# EAGLE design RePico (EAGLE 9.2.1)

## Sheet 1 of 2
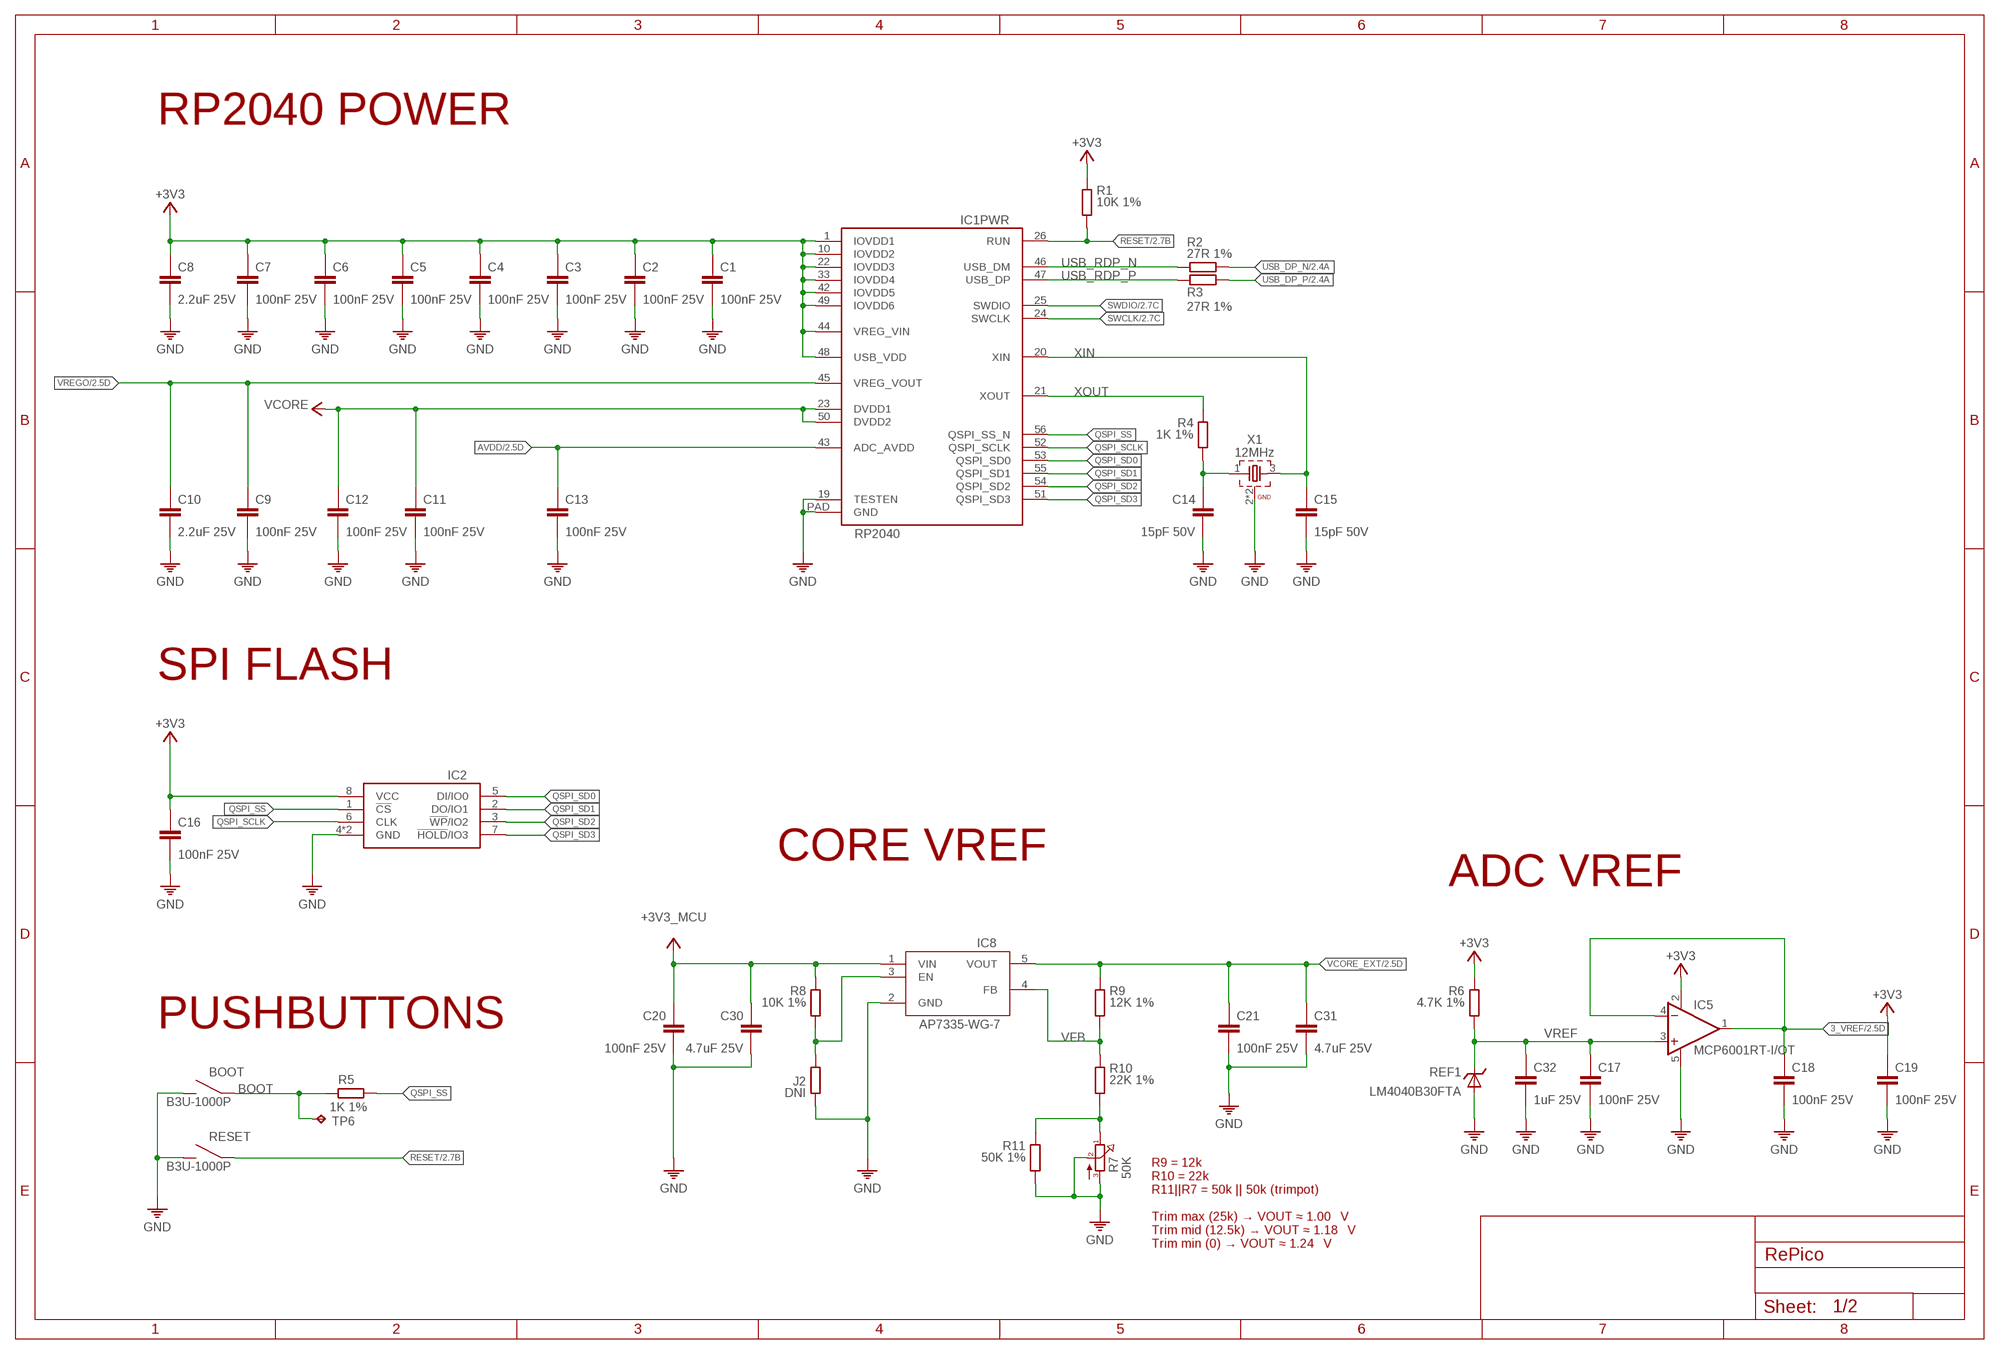
[diagram p0: schematic, sheet 1]

### Parts
BOOT  B3U-1000P  B3U-1000P  [B3U-1000P]
C1  100nF 25V  100NF-25V-0201  [0201]
C2  100nF 25V  100NF-25V-0201  [0201]
C3  100nF 25V  100NF-25V-0201  [0201]
C4  100nF 25V  100NF-25V-0201  [0201]
C5  100nF 25V  100NF-25V-0201  [0201]
C6  100nF 25V  100NF-25V-0201  [0201]
C7  100nF 25V  100NF-25V-0201  [0201]
C8  2.2uF 25V  2.2UF-25V0402  [0402]
C9  100nF 25V  100NF-25V-0201  [0201]
C10  2.2uF 25V  2.2UF-25V0402  [0402]
C11  100nF 25V  100NF-25V-0201  [0201]
C12  100nF 25V  100NF-25V-0201  [0201]
C13  100nF 25V  100NF-25V-0201  [0201]
C14  15pF 50V  15PF-50V0201  [0201]
C15  15pF 50V  15PF-50V0201  [0201]
C16  100nF 25V  100NF-25V-0201  [0201]
C17  100nF 25V  100NF-25V-0201  [0201]
C18  100nF 25V  100NF-25V-0201  [0201]
C19  100nF 25V  100NF-25V-0201  [0201]
C20  100nF 25V  100NF-25V-0201  [0201]
C21  100nF 25V  100NF-25V-0201  [0201]
C30  4.7uF 25V  4.7UF-25V0402  [0402]
C31  4.7uF 25V  4.7UF-25V0402  [0402]
C32  1uF 25V  1UF-25V0402  [0402]
IC1  RP2040  RP-2040  [QFN56]
IC2  W25Q128JVP  [SON127P600X500X75-8N]
IC5  MCP6001RT-I/OT  MCP6001RT  [SOT23-5]
IC8  AP7335-WG-7  AP7335-WG-7  [SOT23-5]
J2  DNI  R0201  [R0201]
R1  10K 1%  10K-1%0201  [0201]
R2  27R 1%  27R-1%0201  [0201]
R3  27R 1%  27R-1%0201  [0201]
R4  1K 1%  1K-1%0201  [0201]
R5  1K 1%  1K-1%0201  [0201]
R6  4.7K 1%  4.7K-1%0402  [0402]
R7  50K  TRIM-3X3.6-TC33X-2-503E  [SMD_TRIMM]
R8  10K 1%  10K-1%0201  [0201]
R9  12K 1%  12K-1%0201  [0201]
R10  22K 1%  22K-1%0201  [0201]
R11  50K 1%  50K-1%0402  [0402]
REF1  LM4040B30FTA  LM4040BXX  [SOT23]
RESET  B3U-1000P  B3U-1000P  [B3U-1000P]
TP6  TPB1,27  [B1,27]
X1  12MHz  CRYSTAL-3225X322512MSB4SI  [WE-XTAL_CFPX-180]

### Nets
3_VREF: C18.1 IC5.1(OUT) IC5.4(-IN) ; also sheet 2
+3V3: C1.1 C2.1 C3.1 C4.1 C5.1 C6.1 C7.1 C8.1 C16.1 C19.1 IC1.1(PWR:IOVDD1) IC1.10(PWR:IOVDD2) IC1.22(PWR:IOVDD3) IC1.33(PWR:IOVDD4) IC1.42(PWR:IOVDD5) IC1.44(PWR:VREG_VIN) IC1.48(PWR:USB_VDD) IC1.49(PWR:IOVDD6) IC2.8(VCC) IC5.2(V+) R1.1 R6.1 ; also sheet 2
+3V3_MCU: C20.1 C30.1 IC8.1(VIN) R8.1
AVDD: C13.1 IC1.43(PWR:ADC_AVDD) ; also sheet 2
BOOT: BOOT.1 R5.1 TP6.TP
FBTRIM: R7.1 R10.2 R11.1
GND: BOOT.2 C1.2 C2.2 C3.2 C4.2 C5.2 C6.2 C7.2 C8.2 C9.2 C10.2 C11.2 C12.2 C13.2 C14.2 C15.2 C16.2 C17.2 C18.2 C19.2 C20.2 C21.2 C30.2 C31.2 C32.2 IC1.19(PWR:TESTEN) IC1.PAD(PWR:GND) IC2.4(GND) IC2.PAD(GND) IC5.5(V-) IC8.2(GND) J2.2 R7.2 R7.3 R11.2 REF1.2(A) REF1.3(A) RESET.2 X1.2(GND) X1.4(GND) ; also sheet 2
N$2: IC8.3(EN) J2.1 R8.2
QSPI_SCLK: IC1.52(PWR:QSPI_SCLK) IC2.6(CLK)
QSPI_SD0: IC1.53(PWR:QSPI_SD0) IC2.5(DI/IO0)
QSPI_SD1: IC1.55(PWR:QSPI_SD1) IC2.2(DO/IO1)
QSPI_SD2: IC1.54(PWR:QSPI_SD2) IC2.3(!WP!/IO2)
QSPI_SD3: IC1.51(PWR:QSPI_SD3) IC2.7(!HOLD!/IO3)
QSPI_SS: IC1.56(PWR:QSPI_SS_N) IC2.1(!CS) R5.2
RESET: IC1.26(PWR:RUN) R1.2 RESET.1 ; also sheet 2
SWCLK: IC1.24(PWR:SWCLK) ; also sheet 2
SWDIO: IC1.25(PWR:SWDIO) ; also sheet 2
USB_DP_N: R2.2 ; also sheet 2
USB_DP_P: R3.2 ; also sheet 2
USB_RDP_N: IC1.46(PWR:USB_DM) R2.1
USB_RDP_P: IC1.47(PWR:USB_DP) R3.1
VCORE: C11.1 C12.1 IC1.23(PWR:DVDD1) IC1.50(PWR:DVDD2) ; also sheet 2
VCORE_EXT: C21.1 C31.1 IC8.5(VOUT) R9.1 ; also sheet 2
VFB: IC8.4(FB) R9.2 R10.1
VREF: C17.1 C32.1 IC5.3(+IN) R6.2 REF1.1(C)
VREGO: C9.1 C10.1 IC1.45(PWR:VREG_VOUT) ; also sheet 2
XIN: C15.1 IC1.20(PWR:XIN) X1.3
XO_R: C14.1 R4.2 X1.1
XOUT: IC1.21(PWR:XOUT) R4.1

### Notes on the sheet
- RP2040 POWER
- SPI FLASH
- CORE VREF
- ADC VREF
- PUSHBUTTONS
- R9 = 12k
  R10 = 22k
  R11||R7 = 50k || 50k (trimpot)
  
  Trim max (25k) → VOUT ≈ 1.00 V  
  Trim mid (12.5k) → VOUT ≈ 1.18 V  
  Trim min (0) → VOUT ≈ 1.24 V

## Sheet 2 of 2
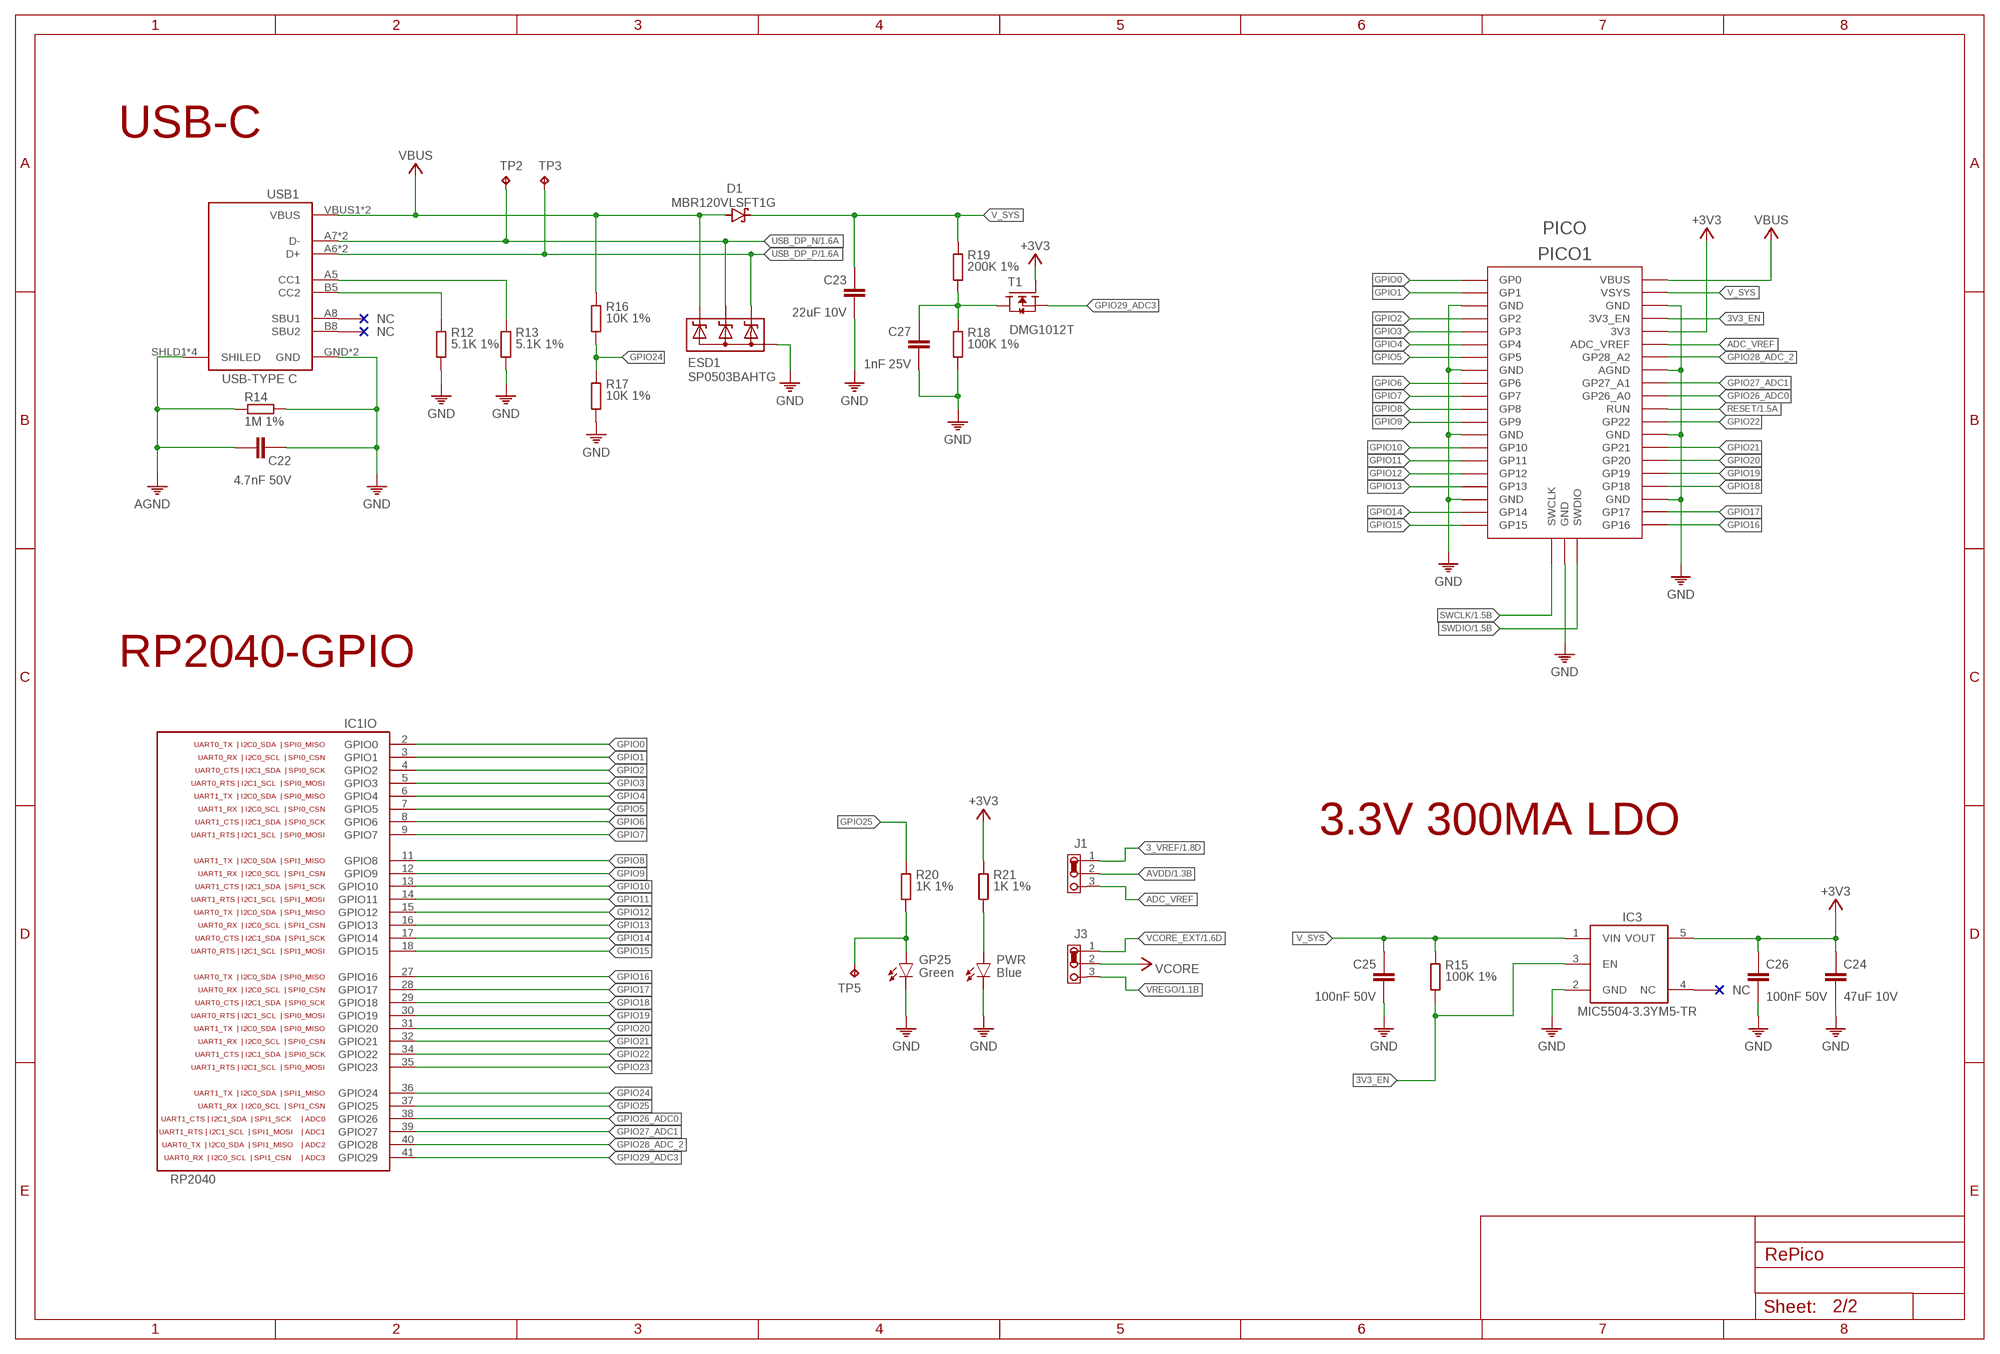
[diagram p1: schematic, sheet 2]

### Parts
C22  4.7nF 50V  4.7NF-50V0603  [0603]
C23  22uF 10V  22UF-10V-0603  [0603]
C24  47uF 10V  47UF-10V0805  [0805]
C25  100nF 50V  100NF-50V-0402  [0402]
C26  100nF 50V  100NF-50V-0402  [0402]
C27  1nF 25V  1NF-25V-0201  [0201]
D1  MBR120VLSFT1G  [SOD-123]
ESD1  SP0503BAHTG  SP0503BAHT  [SOT143]
GP25  Green  LED-GREENLED-0603  [LED-0603]
IC3  MIC5504-3.3YM5  MIC5504-3.3YM5-TR  [SOT23-5]
J1  JUMPER-3  [JUMPER-3]
J3  JUMPER-3  [JUMPER-3]
PICO1  PICO  [PICO]
PWR  Blue  LED-BLUELED-0603  [LED-0603]
R12  5.1K 1%  5.1K-1%0201  [0201]
R13  5.1K 1%  5.1K-1%0201  [0201]
R14  1M 1%  1M-1%0603  [0603]
R15  100K 1%  100K-1%0201  [0201]
R16  10K 1%  10K-1%0201  [0201]
R17  10K 1%  10K-1%0201  [0201]
R18  100K 1%  100K-1%0201  [0201]
R19  200K 1%  200K-1%0201  [0201]
R20  1K 1%  1K-1%0402  [0402]
R21  1K 1%  1K-1%0402  [0402]
T1  DMG1012T  [SOT23]
TP2  TPB1,27  [B1,27]
TP3  TPB1,27  [B1,27]
TP5  TPB1,27  [B1,27]
USB1  USB-TYPE-C-018  USB_C-THT  [USB-C]

### Nets
3_VREF: J1.1 ; also sheet 1
3V3_EN: IC3.3(EN) PICO1.3V3_EN PICO1.3VE(3V3_EN) R15.2
+3V3: C24.1 C26.1 IC3.5(VOUT) PICO1.3V3 PICO1.3V(3V3) R21.1 T1.1(G) ; also sheet 1
ADC_VREF: J1.3 PICO1.ADC_VREF PICO1.AVR(ADC_VREF)
AGND: C22.1 R14.1 USB1.SHLD1(SHILED) USB1.SHLD2(SHILED) USB1.SHLD3(SHILED) USB1.SHLD4(SHILED)
AVDD: J1.2 ; also sheet 1
GND: C22.2 C23.2 C24.2 C25.2 C26.2 C27.2 ESD1.1(A) GP25.C IC3.2(GND) PICO1.AGN(AGND) PICO1.AGND PICO1.G@1(GND) PICO1.G@2(GND) PICO1.G@3(GND) PICO1.G@4(GND) PICO1.G@5(GND) PICO1.G@6(GND) PICO1.G@7(GND) PICO1.G@8(GND) PICO1.GND@1(GND) PICO1.GND@2(GND) PICO1.GND@3(GND) PICO1.GND@4(GND) PICO1.GND@5(GND) PICO1.GND@6(GND) PICO1.GND@7(GND) PICO1.GND@8(GND) PWR.C R12.2 R13.2 R14.2 R17.2 R18.2 USB1.GND USB1.GND2(GND) ; also sheet 1
GPIO0: IC1.2(IO:GPIO0) PICO1.0(GP0) PICO1.GP0
GPIO1: IC1.3(IO:GPIO1) PICO1.1(GP1) PICO1.GP1
GPIO2: IC1.4(IO:GPIO2) PICO1.2(GP2) PICO1.GP2
GPIO3: IC1.5(IO:GPIO3) PICO1.3(GP3) PICO1.GP3
GPIO4: IC1.6(IO:GPIO4) PICO1.4(GP4) PICO1.GP4
GPIO5: IC1.7(IO:GPIO5) PICO1.5(GP5) PICO1.GP5
GPIO6: IC1.8(IO:GPIO6) PICO1.6(GP6) PICO1.GP6
GPIO7: IC1.9(IO:GPIO7) PICO1.7(GP7) PICO1.GP7
GPIO8: IC1.11(IO:GPIO8) PICO1.8(GP8) PICO1.GP8
GPIO9: IC1.12(IO:GPIO9) PICO1.9(GP9) PICO1.GP9
GPIO10: IC1.13(IO:GPIO10) PICO1.10(GP10) PICO1.GP10
GPIO11: IC1.14(IO:GPIO11) PICO1.11(GP11) PICO1.GP11
GPIO12: IC1.15(IO:GPIO12) PICO1.12(GP12) PICO1.GP12
GPIO13: IC1.16(IO:GPIO13) PICO1.13(GP13) PICO1.GP13
GPIO14: IC1.17(IO:GPIO14) PICO1.14(GP14) PICO1.GP14
GPIO15: IC1.18(IO:GPIO15) PICO1.15(GP15) PICO1.GP15
GPIO16: IC1.27(IO:GPIO16) PICO1.16(GP16) PICO1.GP16
GPIO17: IC1.28(IO:GPIO17) PICO1.17(GP17) PICO1.GP17
GPIO18: IC1.29(IO:GPIO18) PICO1.18(GP18) PICO1.GP18
GPIO19: IC1.30(IO:GPIO19) PICO1.19(GP19) PICO1.GP19
GPIO20: IC1.31(IO:GPIO20) PICO1.20(GP20) PICO1.GP20
GPIO21: IC1.32(IO:GPIO21) PICO1.21(GP21) PICO1.GP21
GPIO22: IC1.34(IO:GPIO22) PICO1.22(GP22) PICO1.GP22
GPIO23: IC1.35(IO:GPIO23)
GPIO24: IC1.36(IO:GPIO24) R16.2 R17.1
GPIO25: IC1.37(IO:GPIO25) R20.1
GPIO26_ADC0: IC1.38(IO:GPIO26) PICO1.26(GP26_A0) PICO1.GP26_A0
GPIO27_ADC1: IC1.39(IO:GPIO27) PICO1.27(GP27_A1) PICO1.GP27_A1
GPIO28_ADC_2: IC1.40(IO:GPIO28) PICO1.28(GP28_A2) PICO1.GP28_A2
GPIO29_ADC3: IC1.41(IO:GPIO29) T1.2(S)
N$1: R13.1 USB1.A5(CC1)
N$3: R12.1 USB1.B5(CC2)
N$4: C27.1 R18.1 R19.2 T1.3(D)
N$5: GP25.A R20.2 TP5.TP
N$6: PWR.A R21.2
RESET: PICO1.R(RUN) PICO1.RUN ; also sheet 1
SWCLK: PICO1.SWC(SWCLK) PICO1.SWCLK ; also sheet 1
SWDIO: PICO1.SWD(SWDIO) PICO1.SWDIO ; also sheet 1
USB_DP_N: ESD1.3(C2) TP2.TP USB1.A7(D-) USB1.B7(D-) ; also sheet 1
USB_DP_P: ESD1.2(C1) TP3.TP USB1.A6(D+) USB1.B6(D+) ; also sheet 1
V_SYS: C23.1 C25.1 D1.C IC3.1(VIN) PICO1.VSY(VSYS) PICO1.VSYS R15.1 R19.1
VBUS: D1.A ESD1.4(C3) PICO1.VBU(VBUS) PICO1.VBUS R16.1 USB1.VBUS1(VBUS) USB1.VBUS2(VBUS)
VCORE: J3.2 ; also sheet 1
VCORE_EXT: J3.1 ; also sheet 1
VREGO: J3.3 ; also sheet 1
Unconnected: IC3.4(NC) USB1.A8(SBU1) USB1.B8(SBU2)

### Notes on the sheet
- USB-C
- RP2040-GPIO
- 3.3V 300MA LDO

## Library data of the parts
BOOT RESET = ds_passive:B3U-1000P: 2.5mm 1.6mm Round Button 50mA Standing paste 3mm SPST 153gf 12V SMD,2.5x3mm Tactile Switches ROHS; DATASHEET: https://omronfs.omron.com/en_US/ecb/products/pdf/en-b3u.pdf; DESCRIPTION: 2.5mm 1.6mm Round Button 50mA Standing paste 3mm SPST 153gf 12V SMD,2.5x3mm Tactile Switches ROHS; LCSC_PART: C231329
C1-C7 C9 C11-C13 C16-C21 = ds_capacitors:100NF-25V; DESCRIPTION: 25V 100nF X5R ±10% 0201 Multilayer Ceramic Capacitors MLCC - SMD/SMT ROHS; LCSC_PART: C76939
C8 C10 = ds_capacitors:2.2UF-25V; DESCRIPTION: 25V 2.2uF X5R ±10% 0402 Multilayer Ceramic Capacitors MLCC - SMD/SMT ROHS; LCSC_PART: C385032
C14 C15 = ds_capacitors:15PF-50V; DESCRIPTION: 50V 15pF C0G ±5% 0201 Multilayer Ceramic Capacitors MLCC - SMD/SMT ROHS; LCSC_PART: C22374851
C22 = ds_capacitors:4.7NF-50V; DESCRIPTION: 50V 4.7nF X7R ±10% 0603 Multilayer Ceramic Capacitors MLCC - SMD/SMT ROHS; LCSC_PART: C53987
C23 = ds_capacitors:22UF-10V; DESCRIPTION: 10V 22uF X5R ±20% 0603 Multilayer Ceramic Capacitors MLCC - SMD/SMT ROHS; LCSC_PART: C60077
C24 = ds_capacitors:47UF-10V; DESCRIPTION: 10V 47uF X5R ±20% 0805 Multilayer Ceramic Capacitors MLCC - SMD/SMT ROHS; LCSC_PART: C6119904
C25 C26 = ds_capacitors:100NF-50V; DESCRIPTION: 50V 100nF X7R ±10% 0402 Multilayer Ceramic Capacitors MLCC - SMD/SMT ROHS; LCSC_PART: C307331
C27 = ds_capacitors:1NF-25V; DESCRIPTION: 25V 1nF X7R ±10% 0201 Multilayer Ceramic Capacitors MLCC - SMD/SMT ROHS; LCSC_PART: C7694325V
C30 C31 = ds_capacitors:4.7UF-25V; DESCRIPTION: 25V 4.7uF X5R ±20% 0402 Multilayer Ceramic Capacitors MLCC - SMD/SMT ROHS; LCSC_PART: C22367824
C32 = ds_capacitors:1UF-25V; DESCRIPTION: 25V 1uF X5R ±10% 0402 Multilayer Ceramic Capacitors MLCC - SMD/SMT ROHS; LCSC_PART: C52923
D1 = ds_diode:MBR120VLSFT1G: 20V 300mV@1A 1A SOD-123FL Schottky Diodes ROHS; DESCRIPTION: 20V 300mV@1A 1A SOD-123FL Schottky Diodes ROHS; LCSC_PART: C223608
ESD1 = ds_ic_peripherals:SP0503BAHT: TVS Diode Arrays Surface Mount TVS Avalanche Diode Array; DESCRIPTION: SOT-143 ESD and Surge Protection (TVS/ESD) ROHS; LCSC_PART: C3040626
GP25 = ds_LED:LED-GREEN; DESCRIPTION: 20mA 810mcd Colorless and transparent Individual diode 515nm~535nm -20℃~+85℃ Positive Stick Emerald 120° 70mW 3.3V 0603 LED Indication - Discrete ROHS; LCSC_PART: C965804
IC1 = ds_ic_mcu:RP-2040: Key features: • Dual ARM Cortex-M0+ @ 133MHz • 264kB on-chip SRAM in six independent banks • Support for up to 16MB of off-chip Flash memory via dedicated QSPI bus • DMA controller • Fully-connected AHB crossbar • Interpolator and integer divider peripherals • On-chip programmable LDO to generate core voltage • 2 on-chip PLLs to generate USB and core clocks • 30 GPIO pins, 4 of which can be used as analogue inputs • Peripherals ◦2 UARTs ◦2 SPI controllers ◦2 I2C controllers ◦16 PWM channels ◦USB 1.1 controller and PHY, with host and device support ◦8 PIO state machines; DATASHEET: https://datasheets.raspberrypi.com/rp2040/rp2040-datasheet.pdf; DESCRIPTION: 133MHz LQFN-56(7x7) Microcontrollers (MCU/MPU/SOC) ROHS; LCSC_PART: C2040
IC2 = ds_ic_memory:W25Q128JV: 3V 128M-BIT SERIAL FLASH MEMORY WITH DUAL/QUAD SPI & QPI & DTR
IC3 = ds_ic_vreg:MIC5504-3.3YM5-TR: The MIC5501/2/3/4 is an advanced general-purpose LDO ideal for powering general-purpose portable devices. The MIC5501/2/3/4 family of products provides a high-performance 300mA LDO; DATASHEET: https://ww1.microchip.com/downloads/en/DeviceDoc/MIC5501-02-03-04-300mA-Single-Output-LDO-in-Small-Packages-DS20006006B.pdf; DESCRIPTION: SOT-23-5 Voltage Regulators - Linear, Low Drop Out (LDO) Regulators ROHS; LCSC_PART: C41348078
IC5 = ds_ic_opa:MCP6001RT: 1 MHz, Low-Power Op Amp; DESCRIPTION: Single 1pA 0.6V/us 1MHz SOT-23-5 Operational Amplifier ROHS; LCSC_PART: C154973
IC8 = ds_ic_vreg:AP7335-WG-7: 300mA, LOW QUIESCENT CURRENT, FAST TRANSIENT LOW DROPOUT LINEAR REGULATOR; DATASHEET: https://www.diodes.com/assets/Datasheets/AP7335.pdf; DESCRIPTION: 300mA 65dB@(1kHz) Adjustable 800mV~5V Positive electrode 6V SOT-25 Voltage Regulators - Linear, Low Drop Out (LDO) Regulators ROHS; LCSC_PART: C460382
J1 J3 = ds_passive:JUMPER-3
J2 = ds_passive:R
PICO1 = ds_con:PICO
PWR = ds_LED:LED-BLUE; DESCRIPTION: 20mA 240mcd Colorless and transparent -20℃~+85℃ Positive Stick 455nm~475nm Blue 120° 70mW 3.3V 0603 LED Indication - Discrete ROHS; LCSC_PART: C965807
R1 R8 R16 R17 = ds_resistor:10K-1%; DESCRIPTION: 50mW Thick Film Resistors 25V ±1% ±200ppm/℃ 10kΩ 0201 Chip Resistor - Surface Mount ROHS; LCSC_PART: C473048
R2 R3 = ds_resistor:27R-1%; DESCRIPTION: 50mW Thick Film Resistors 25V ±1% ±200ppm/℃ 27Ω 0201 Chip Resistor - Surface Mount ROHS; LCSC_PART: C473051
R4 R5 = ds_resistor:1K-1%; DESCRIPTION: 50mW Thick Film Resistors 25V ±1% ±200ppm/℃ 1kΩ 0201 Chip Resistor - Surface Mount ROHS; LCSC_PART: C270365
R6 = ds_resistor:4.7K-1%; DESCRIPTION: 62.5mW Thick Film Resistors 50V ±100ppm/℃ ±1% 4.7kΩ 0402 Chip Resistor - Surface Mount ROHS; LCSC_PART: C25900
R7 = ds_resistor:TRIM-3X3.6; DESCRIPTION: ±25% ±250ppm/℃ 100mW 50kΩ SMD-3P,3.8x3.6mm Potentiometers, Variable Resistors ROHS; LCSC_PART: C913246
R9 = ds_resistor:12K-1%; DESCRIPTION: 50mW Thick Film Resistors 25V ±1% ±200ppm/℃ 12kΩ 0201 Chip Resistor - Surface Mount ROHS; LCSC_PART: C270363
R10 = ds_resistor:22K-1%; DESCRIPTION: 50mW Thick Film Resistors 25V ±1% ±200ppm/℃ 22kΩ 0201 Chip Resistor - Surface Mount ROHS; LCSC_PART: C474416
R11 = ds_resistor:50K-1%; DESCRIPTION: 62.5mW Thick Film Resistors 50V ±100ppm/℃ ±1% 50kΩ 0402 Chip Resistor - Surface Mount ROHS; LCSC_PART: C166559
R12 R13 = ds_resistor:5.1K-1%; DESCRIPTION: 50mW Thick Film Resistors 25V ±1% ±200ppm/℃ 5.1kΩ 0201 Chip Resistor - Surface Mount ROHS; LCSC_PART: C274341
R14 = ds_resistor:1M-1%; DESCRIPTION: 100mW Thick Film Resistors 75V ±100ppm/℃ ±1% 1MΩ 0603 Chip Resistor - Surface Mount ROHS; LCSC_PART: C22935
R15 R18 = ds_resistor:100K-1%; DESCRIPTION: 50mW Thick Film Resistors 25V ±1% ±200ppm/℃ 100kΩ 0201 Chip Resistor - Surface Mount ROHS; LCSC_PART: C270364
R19 = ds_resistor:200K-1%; DESCRIPTION: 50mW Thick Film Resistors 25V ±1% ±200ppm/℃ 200kΩ 0201 Chip Resistor - Surface Mount ROHS; LCSC_PART: C270357
R20 R21 = ds_resistor:1K-1%; DESCRIPTION: 62.5mW Thick Film Resistors 50V ±100ppm/℃ ±1% 1kΩ 0402 Chip Resistor - Surface Mount ROHS; LCSC_PART: C11702
REF1 = ds_ic_vreg:LM4040BXX: Fixed voltage, 45-µA, precision micropower shunt voltage reference; DESCRIPTION: 3V ±0.2% 15mA Fixed SOT-23 Voltage Reference ROHS; LCSC_PART: C460604
T1 = ds_active:DMG1012T: 20V 800mA 250mΩ@4.5V 280mW 750mV@250uA 1 N-channel SOT-523-3 MOSFETs ROHS; DESCRIPTION: 20V 800mA 250mΩ@4.5V 280mW 750mV@250uA 1 N-channel SOT-523-3 MOSFETs ROHS; LCSC_PART: C2830301
TP2 TP3 TP5 TP6 = testpad:TP: Test pad
USB1 = ds_con:USB_C; DESCRIPTION: 3A 1 Horizontal attachment 16P Female -25℃~+85℃ Type-C SMD USB Connectors ROHS; LCSC_PART: C2927038
X1 = ds_passive:CRYSTAL-3225; DESCRIPTION: 12MHz Surface Mount Crystal 20pF ±10ppm ±20ppm SMD3225-4P Crystals ROHS; LCSC_PART: C9002

## Net classes
0 50R_SE: width 0.149 mm, drill 0.15 mm, clearance 0.178 mm
1 90R_DP: width 0.149 mm, drill 0.15 mm, clearance 0.178 mm

## Board
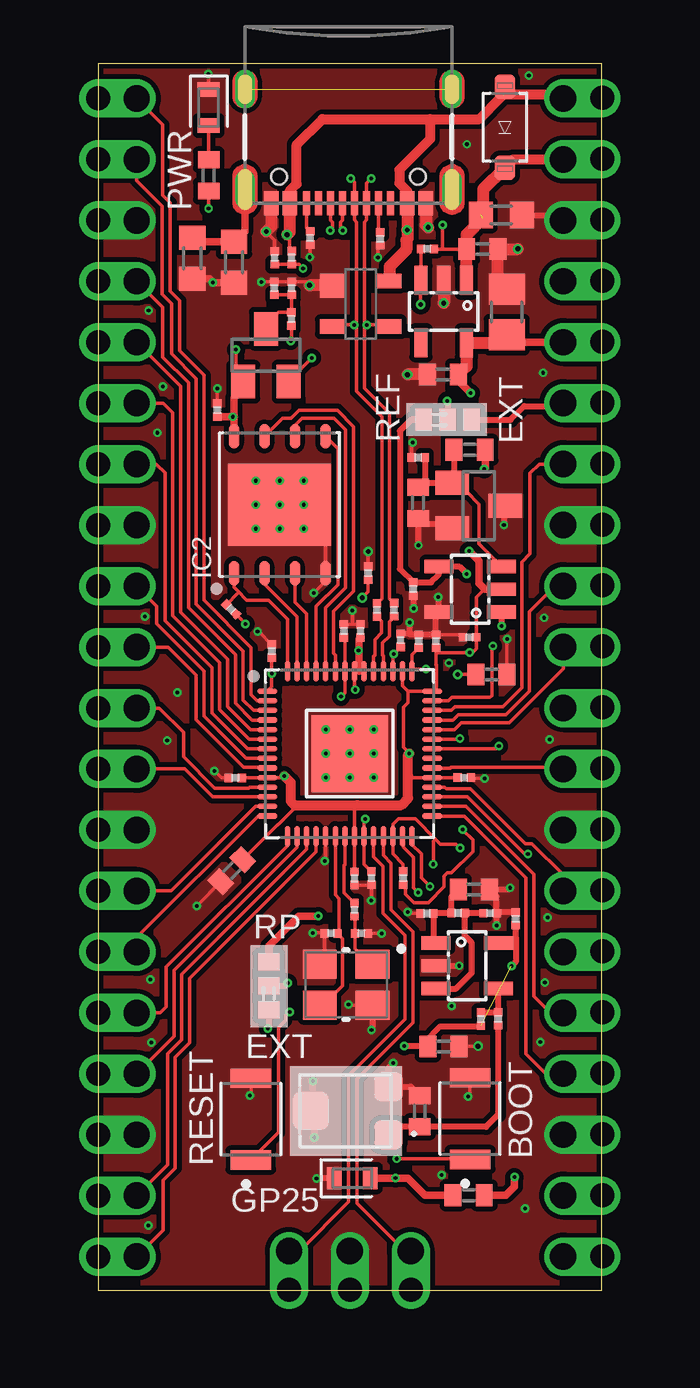
[diagram p2: board, top side]
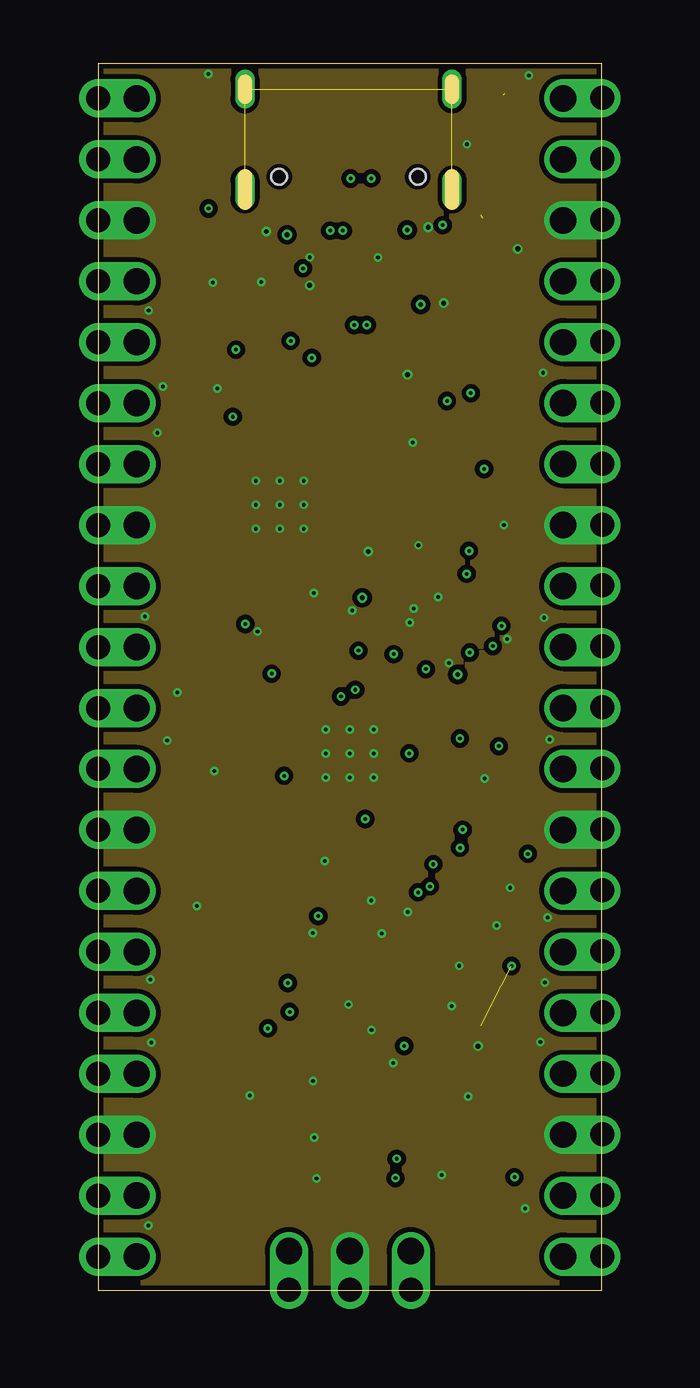
[diagram p3: board, inner layer GND-1]
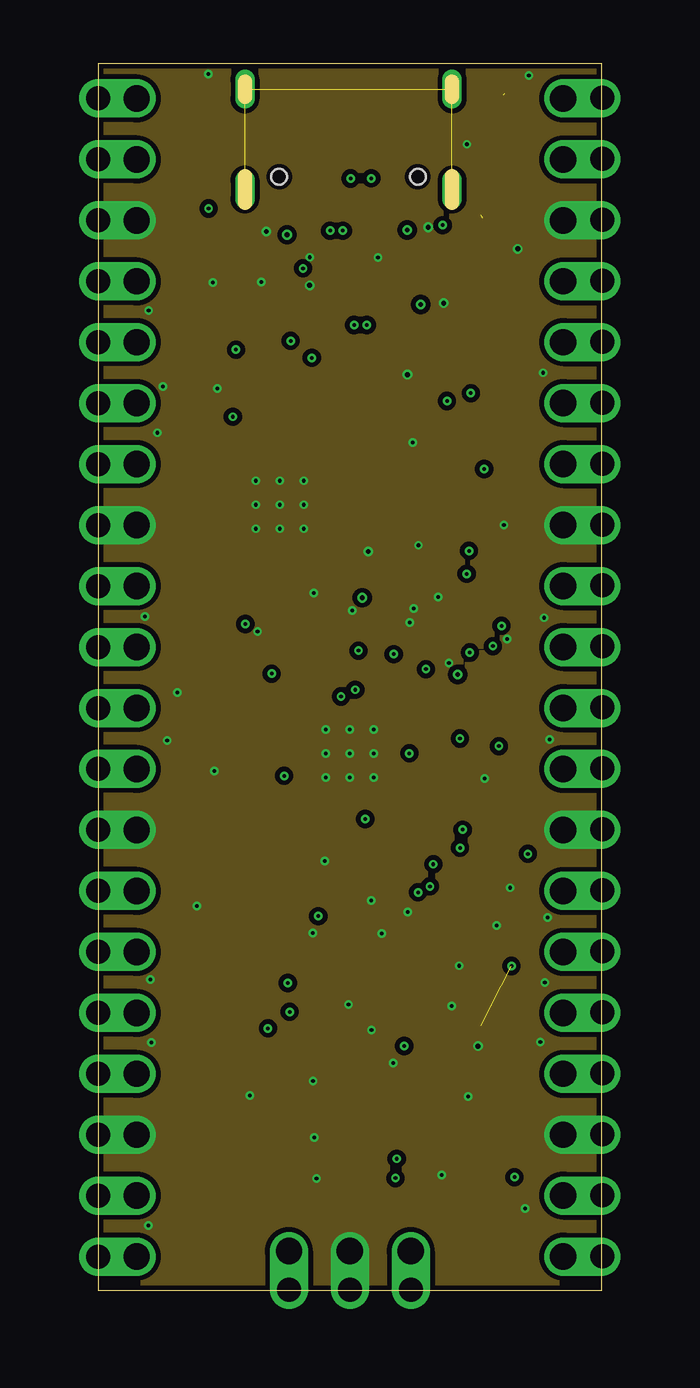
[diagram p4: board, inner layer GND-2]
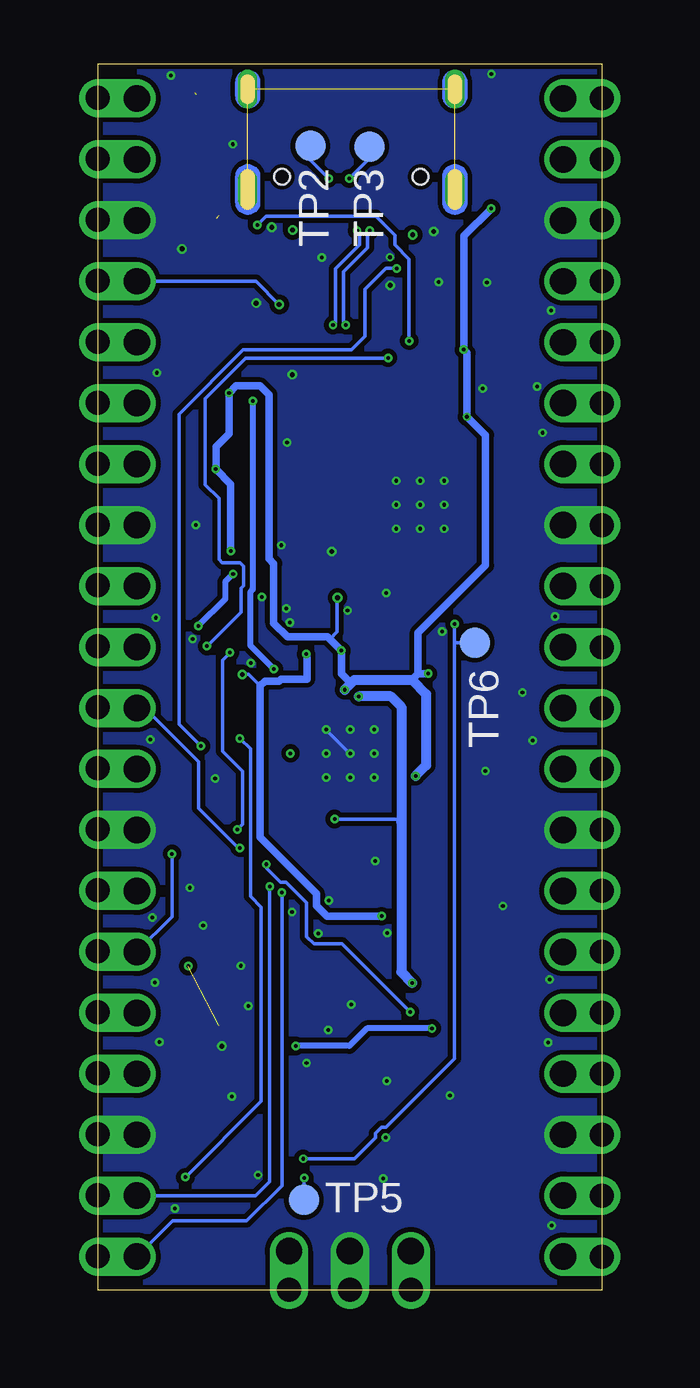
[diagram p5: board, bottom side, seen from below]

Size 21 x 51.1 mm. Coordinates in mm from the lower left corner, seen from the top.
Outline: 0,0 21,0 21,51.1 0,51.1 0,0
Copper layers (1+2*15+16): SIG-1 0.035mm / dielectric 0.15mm / GND-1 0.0175mm / dielectric 1.265mm / GND-2 0.0175mm / dielectric 0.15mm / SIG-2 0.035mm
Design rules "JLC04161H-3313_4-layer_1.6mm-minimum *": minimum track width 0.1mm, minimum drill 0.15mm, track to track 3.5mil, track to pad 3.5mil, pad to pad 3.5mil, via to via 3.5mil, smd to smd 3.5mil, copper to edge 0.2mm, drill to drill 6mil, minimum pad ring 8mil, minimum via ring 0.1mm, stop-mask expansion 0.05mm, vias tented up to drill 16mil, thermal gap 10mil

### Footprints (pad centres in the part's own frame; a part is rotated, then mirrored left to right if it is on the bottom)
B3U-1000P = smd 0.8 x 1.7: 1 -1.7,0; 2 1.7,0
0201 = smd 0.34 x 0.35: 1 -0.275,0; 2 0.275,0
0402 = smd 0.7 x 0.9: 1 -0.65,0; 2 0.65,0
0603 = smd 1 x 1.1: 1 -0.85,0; 2 0.85,0
0805 = smd 1.3 x 1.5: 1 -0.95,0; 2 0.95,0
SOD-123 = smd 1.02 x 0.86: A 1.68,0; C -1.68,0
SOT143 = smd 1 x 1: 1 -0.75,-1.2 | smd 0.6 x 1: 2 0.95,-1.2; 3 0.95,1.2; 4 -0.95,1.2
LED-0603 = smd 0.612 x 0.912: A 0.75,0; C -0.75,0
QFN56 = smd 0.837 x 0.22: 1 -3.437,2.6; 2 -3.437,2.2; 3 -3.437,1.8; 4 -3.437,1.4; 5 -3.437,1; 6 -3.437,0.6; 7 -3.437,0.2; 8 -3.437,-0.2; 9 -3.437,-0.6; 10 -3.437,-1; 11 -3.437,-1.4; 12 -3.437,-1.8; 13 -3.437,-2.2; 14 -3.437,-2.6; 29 3.437,-2.6; 30 3.437,-2.2; 31 3.437,-1.8; 32 3.437,-1.4; 33 3.437,-1; 34 3.437,-0.6; 35 3.437,-0.2; 36 3.437,0.2; 37 3.437,0.6; 38 3.437,1; 39 3.437,1.4; 40 3.437,1.8; 41 3.437,2.2; 42 3.437,2.6 | smd 0.22 x 0.837: 15 -2.6,-3.437; 16 -2.2,-3.437; 17 -1.8,-3.437; 18 -1.4,-3.437; 19 -1,-3.437; 20 -0.6,-3.437; 21 -0.2,-3.437; 22 0.2,-3.437; 23 0.6,-3.437; 24 1,-3.437; 25 1.4,-3.437; 26 1.8,-3.437; 27 2.2,-3.437; 28 2.6,-3.437; 43 2.6,3.437; 44 2.2,3.437; 45 1.8,3.437; 46 1.4,3.437; 47 1,3.437; 48 0.6,3.437; 49 0.2,3.437; 50 -0.2,3.437; 51 -0.6,3.437; 52 -1,3.437; 53 -1.4,3.437; 54 -1.8,3.437; 55 -2.2,3.437; 56 -2.6,3.437 | smd 3.2 x 3.2: PAD 0,0
SON127P600X500X75-8N = smd 1.012 x 0.432: 1 -2.85,1.905; 2 -2.85,0.635; 3 -2.85,-0.635; 4 -2.85,-1.905; 5 2.85,-1.905; 6 2.85,-0.635; 7 2.85,0.635; 8 2.85,1.905 | smd 3.4 x 4.3: PAD 0,0
SOT23-5 = smd 0.55 x 1.2: 1 -0.95,-1.3; 2 0,-1.3; 3 0.95,-1.3; 4 0.95,1.3; 5 -0.95,1.3
JUMPER-3 = smd 0.7 x 0.9: 1 -0.65,0; 2 0.35,0; 3 1.35,0
R0201 = smd 0.34 x 0.35: 1 -0.275,0; 2 0.275,0
PICO = drill 1: 0 -10.5,25.4; 1 -10.5,22.86; 2 -10.5,17.78; 3 -10.5,15.24; 3V 10.515,15.265; 3VE 10.515,17.805; 4 -10.5,12.7; 5 -10.5,10.16; 6 -10.5,5.08; 7 -10.5,2.54; 8 -10.5,0; 9 -10.5,-2.54; 10 -10.5,-7.62; 11 -10.5,-10.16; 12 -10.5,-12.7; 13 -10.5,-15.24; 14 -10.5,-20.32; 15 -10.5,-22.86; 16 10.515,-22.835; 17 10.515,-20.295; 18 10.515,-15.215; 19 10.515,-12.675; 20 10.515,-10.135; 21 10.515,-7.595; 22 10.515,-2.515; 26 10.515,2.565; 27 10.515,5.105; 28 10.515,10.185; AGN 10.515,7.645; AVR 10.515,12.725; G@1 -10.5,20.32; G@2 -10.5,7.62; G@3 -10.5,-5.08; G@4 -10.5,-17.78; G@5 0,-24.235; G@6 10.515,-17.755; G@7 10.515,-5.055; G@8 10.515,20.345; R 10.515,0.025; SWC -2.54,-24.235; SWD 2.54,-24.235; VBU 10.515,25.425; VSY 10.515,22.885 | drill 1.1 pad 1.6 offset: 3V3 8.89,15.24; 3V3_EN 8.89,17.78; ADC_VREF 8.89,12.7; AGND 8.89,7.62; GND@1 -8.89,20.32; GND@2 -8.89,7.62; GND@3 -8.89,-5.08; GND@4 -8.89,-17.78; GND@5 0,-22.63; GND@6 8.89,-17.78; GND@7 8.89,-5.08; GND@8 8.89,20.32; GP0 -8.89,25.4; GP1 -8.89,22.86; GP2 -8.89,17.78; GP3 -8.89,15.24; GP4 -8.89,12.7; GP5 -8.89,10.16; GP6 -8.89,5.08; GP7 -8.89,2.54; GP8 -8.89,0; GP9 -8.89,-2.54; GP10 -8.89,-7.62; GP11 -8.89,-10.16; GP12 -8.89,-12.7; GP13 -8.89,-15.24; GP14 -8.89,-20.32; GP15 -8.89,-22.86; GP16 8.89,-22.86; GP17 8.89,-20.32; GP18 8.89,-15.24; GP19 8.89,-12.7; GP20 8.89,-10.16; GP21 8.89,-7.62; GP22 8.89,-2.54; GP26_A0 8.89,2.54; GP27_A1 8.89,5.08; GP28_A2 8.89,10.16; RUN 8.89,0; SWCLK -2.54,-22.63; SWDIO 2.54,-22.63; VBUS 8.89,25.4; VSYS 8.89,22.86
SMD_TRIMM = smd 1.2 x 1.2: 1 -1,-1.8; 3 1,-1.8 | smd 1.6 x 1.5: 2 0,1.45
SOT23 = smd 1 x 1.4: 1 -0.95,-1.1; 2 0.95,-1.1; 3 0,1.1
B1,27 = smd 1.27 x 1.27: TP 0,0
USB-C = smd 0.3 x 1: A5 -1.18,3.37; A6 -0.18,3.37; A7 0.32,3.37; A8 1.32,3.37; B5 1.82,3.37; B6 0.82,3.37; B7 -0.68,3.37; B8 -1.68,3.37 | smd 0.6 x 1: GND -3.155,3.37; GND2 3.295,3.37; VBUS1 -2.38,3.37; VBUS2 2.52,3.37 | drill 0.4 pad 0.6 long: SHLD1 -4.248,2.795; SHLD2 4.388,2.795; SHLD3 -4.248,-1.385; SHLD4 4.388,-1.385 | hole 0.65: -2.82,2.265; 2.96,2.265
WE-XTAL_CFPX-180 = smd 1.4 x 1.2: 1 -1.1,-0.85; 2 1.1,-0.85; 3 1.1,0.85; 4 -1.1,0.85

### Placement (x,y rotation side)
BOOT  15.51,7.14 90 top
C1  7.24,26.62 90 top
C2  5.72,21.34 180 top
C3  10.69,17.15 270 top
C4  15.27,21.35 0 top
C5  14.09,27.03 90 top
C6  11.26,29.87 90 top
C7  10.94,27.46 90 top
C8  5.57,17.47 225 top
C9  12.61,27.07 90 top
C10  16.4,25.65 0 top
C11  11.4,17.16 270 top
C12  10.25,27.46 90 top
C13  13.37,27.03 90 top
C14  10.98,14.86 0 top
C15  9.71,14.86 180 top
C16  4.97,36.66 90 top
C17  13.35,34.69 180 top
C18  13.14,29.21 270 top
C19  15.49,27.2 180 top
C20  13.71,15.69 180 top
C21  17.41,15.47 90 top
C22  3.93,42.99 270 top
C23  16.81,44.79 0 top
C24  17.04,40.75 90 top
C25  16.02,43.37 0 top
C26  14.38,38.15 180 top
C27  7.35,41.74 90 top
C30  15.67,16.69 0 top
C31  14.4,10.15 0 top
C32  13.34,32.8 270 top
D1  16.96,48.45 90 top
ESD1  10.95,41.09 270 top
GP25  10.6,4.66 0 top
IC1  10.49,22.35 0 top
IC2  7.57,32.72 90 top
IC3  14.41,40.77 180 top
IC5  15.51,29.2 90 top
IC8  15.39,13.51 270 top
J1  14.23,36.26 0 top
J2  16.34,15.7 0 top
J3  7.12,12.33 90 top
PICO1  10.5,24.25 0 top
PWR  4.61,49.27 270 top
R1  12.72,17.16 90 top
R2  12.34,28.35 90 top
R3  11.63,28.34 90 top
R4  10.69,15.85 270 top
R5  5.55,28.37 135 top
R6  15.49,35.01 180 top
R7  10.31,7.47 90 top
R8  15.01,15.71 0 top
R9  15.96,11.29 90 top
R10  16.68,11.3 270 top
R11  13.41,7.45 90 top
R12  8.84,43.84 270 top
R13  11.76,43.8 270 top
R14  5.67,42.82 270 top
R15  13.73,43.38 180 top
R16  8.07,43.02 270 top
R17  7.36,43.01 90 top
R18  8.07,41.74 90 top
R19  8.06,40.46 90 top
R20  15.45,3.95 180 top
R21  4.61,46.44 90 top
REF1  15.87,32.68 270 top
RESET  6.37,7.12 90 top
T1  7,38.95 0 top
TP2  12.15,47.67 180 bottom
TP3  9.69,47.64 180 bottom
TP5  12.42,3.76 0 bottom
TP6  5.29,26.97 0 bottom
USB1  10.51,48.65 180 top
X1  10.34,12.72 180 top

### Tracks (layer width: path | path; a pad name or v marks a point on that pad's centre or on a via)
3_VREF  (via drill 0.15 pad 0.25)
  SIG-1 0.254: J1.1 13.05,36.26 12.59,35.8 12.59,30.04 C18.1 13.88,29.48 14.21,29.81 14.21,30.13 | 14.21,30.13 IC5.4 | IC5.1 v16.81,27.68 v16.82,27.67 | v15.37,29.84 15.08,30.13 14.21,30.13
  SIG-2 0.254: v16.82,27.67 15.7,28.79 15.7,29.51 v15.37,29.84
3V3_EN  (via drill 0.2 pad 0.25)
  SIG-1 0.149: v13.45,41.06 IC3.3 R15.2 | PICO1.3V3_EN 20.99,42.03 PICO1.3VE
  SIG-2 0.149: PICO1.3V3_EN 14.42,42.03 v13.45,41.06
+3V3  (via drill 0.15 pad 0.25, 0.2)
  SIG-1 0.149: 10.81,26.69 10.81,25.91 IC1.49 10.87,25.79 IC1.48 | 10.81,27.05 C7.1 | C1.1 v7.24,25.68 7.24,25.14 IC1.1 | IC1.22 C3.1 | C2.1 IC1.10 | PICO1.3V3 20.99,39.49 PICO1.3V | R1.1 12.82,16.78 12.82,16.48 13.16,16.14 13.77,16.14 14.42,16.79 14.42,17.24 14.57,17.39 14.74,17.39 15.62,18.27 15.62,18.76 v15.2,19.18
  SIG-1 0.15: IC1.44 12.69,25.18 12.92,24.95 IC1.42 14.1,25.12 14.1,26.05 14.09,26.05 14.09,26.56 | IC5.2 16.1,29.2 15.77,28.86 C19.1 15.77,26.73 15.6,26.56 v15.5,26.56 14.09,26.56 | 12.93,21.42 13,21.35 IC1.33 C4.1 | C5.1 14.09,26.56 | v10.86,26.64 10.81,26.69
  SIG-1 0.152: R21.1 v4.61,45.06 | v5.75,39.18 5.75,38.15 T1.1 | IC1.49 10.69,25.04 v10.72,25.01 | v7.76,21.42 7.69,21.35 IC1.10 | IC1.22 10.69,20.08 10.81,20.2 | 12.92,24.95 12.92,24.47 12.73,24.28 12.73,22.61 v12.98,22.36 | C6.1 11.26,29.09 v11.02,28.84 | C8.1 7.49,19.39 7.51,19.39 8.2,20.07 8.2,20.2
  SIG-1 0.305: IC2.8 5.67,36.34 | 5.67,36.34 5.67,37.19 6.05,37.57 T1.1 | C16.1 v5.62,36.38 5.67,36.34 | 10.87,25.79 10.87,27.11 C7.1 | v15.54,37.37 15.03,37.88 C26.1 | v16.1,34.21 16.14,34.25 R6.1 | v15.47,30.8 15.88,30.39 15.88,29.46 16.14,29.2 IC5.2 | PICO1.3V3 17.35,39.49 C24.1
  SIG-1 0.406: v7.76,21.42 8.03,21.15 8.03,20.37 8.2,20.2 10.81,20.2 12.64,20.2 12.93,20.49 12.93,21.42 12.93,22.31 v12.98,22.36
  SIG-1 0.508: C24.1 16.71,39.47 IC3.5 15.36,38.48 C26.1
  SIG-2 0.149: v15.2,19.18 14.98,19.4 14.98,21.61 15.81,22.44 15.81,26.25 v15.5,26.56
  SIG-2 0.152: 11.34,27.12 11.03,27.43 v11.03,28.83 v11.02,28.84
  SIG-2 0.305: 7.92,25.42 7.66,25.68 | 7.66,25.68 v7.24,25.68 | 7.66,25.68 7.66,27.38 4.85,30.19 4.85,35.62 v5.62,36.38 5.62,39.05 v5.75,39.18 5.75,43.92 v4.61,45.06 | 10.46,25.27 10.86,25.68 v10.86,26.64 11.34,27.12 11.43,27.21 13.1,27.21 13.68,27.78 13.68,30.27 13.88,30.47 13.88,37.31 14.24,37.67 15.24,37.67 v15.54,37.37 15.54,35.68 16.09,35.13 v16.09,34.22 v16.1,34.21 15.47,33.58 v15.47,30.8
  SIG-2 0.406: v10.72,25.01 10.46,25.27 10.31,25.42 7.92,25.42 7.33,24.83 7.33,21.85 v7.76,21.42
+3V3_MCU
  SIG-1 0.254: C30.1 14.73,16.41 R8.1 14.01,15.71 C20.1 13.98,14.56 IC8.1
ADC_VREF
  SIG-1 0.149: PICO1.ADC_VREF 20.99,36.95 PICO1.AVR
  SIG-1 0.254: J1.3 17.2,36.26 17.77,36.83 19.27,36.83 PICO1.ADC_VREF
AGND  (3 unrouted)
  SIG-1 0.305: C22.1 4.1,43.67 R14.1 6.12,44.12 USB1.SHLD2
AVDD  (via drill 0.15 pad 0.25)
  SIG-1 0.15: C13.1 13.09,26.48 IC1.43 13.17,25.87 v13.67,25.87
  SIG-1 0.254: J1.2 14.58,37.01 v14.55,37.04
  SIG-2 0.254: v14.55,37.04 14.55,29.19 14.66,29.08 14.66,26.86 v13.67,25.87
BOOT  (via drill 0.15 pad 0.25)
  SIG-1 0.149: R5.1 6.14,27.77 v6.14,27.75 | v12.45,5.47 15.48,5.47 BOOT.1
  SIG-2 0.149: v6.14,27.75 6.14,27 | 6.14,27 6.14,9.64 9,6.78 9.19,6.78 9.44,6.53 9.44,6.34 10.31,5.47 v12.45,5.47 | TP6.TP 6.11,26.97 6.14,27
FBTRIM
  SIG-1 0.254: R10.2 16.68,7.3 16.18,6.8 R11.1 12.44,6.8 R7.1
GND  (via drill 0.15 pad 0.25, 0.2, 0.2 pad 0.25)
  SIG-1 0.149: v8.95,14.88 9.41,14.88 C15.2 9.44,13.77 X1.2 | C14.2 v11.81,14.86 v11.82,14.85 | X1.4 10.46,11.87 v10.44,11.89 | C3.2 11.39,16.88 C11.2 v11.4,16.24 v11.39,16.23 | IC1.19 9.49,17.92 v9.45,17.88 | RESET.2 6.37,8.14 v6.33,8.1 | BOOT.2 15.51,8.15 v15.43,8.07 | R12.2 8.83,43.55 v8.83,43.03 | v8.82,41.86 8.66,42.02 R18.2 C27.2 6.82,42.02 v6.8,42 | R17.2 7.36,43.75 v7.01,44.1 | R13.2 11.67,43.44 v11.67,43.02 | C16.2 v4.97,37.56 | v8.57,31.72 8.94,31.72 9.47,31.18 IC2.4 9.47,29.52 v8.99,29.04 | C1.2 6.71,27.43 v6.65,27.43 | C12.2 10.6,27.73 | 10.6,27.73 C7.2 | 10.6,27.73 v10.6,28.32 | C2.2 5.14,21.34 v4.85,21.63 | PICO1.GND@4 PICO1.G@4 | PICO1.GND@3 PICO1.G@3 | PICO1.GND@2 PICO1.G@2 | PICO1.GND@1 PICO1.G@1 | PICO1.GND@8 20.99,44.57 PICO1.G@8 | PICO1.AGND 20.99,31.87 PICO1.AGN | PICO1.GND@7 20.99,19.17 PICO1.G@7 | PICO1.GND@6 20.99,6.47 PICO1.G@6 | PICO1.GND@5 PICO1.G@5 | C17.2 13.07,35.27 v13.12,35.32
  SIG-1 0.15: C19.2 15.11,27.3 C5.2 | C20.2 12.97,15.69 v12.91,15.74 | C4.2 15.57,21.32 v16.12,21.32
  SIG-1 0.152: PWR.C v4.61,50.65 v4.6,50.66 | C31.2 v15.83,10.15 v15.84,10.16 | C6.2 v11.26,30.77 | C10.2 v17.05,27.12 v17.06,27.13 | C8.2 4.12,16.02 v4.12,16
  SIG-1 0.254: v14.18,28.88 14.21,28.85 IC5.5 14.09,28.13 C5.2 C13.2 13.01,27.3 13.01,27.34 | C18.2 13.14,28.41 v13.16,28.39 | 13.01,27.34 C9.2 | 13.01,27.34 v13.01,27.81 v13,27.82 | C32.2 13.34,31.9 | 13.34,31.9 13.34,31.05 v13.36,31.03 | REF1.2 14.6,31.9 13.34,31.9 | REF1.3 16.92,32.63 v16.92,31.87 | IC8.2 v15.05,13.51 | J2.2 16.61,16.39 C30.2 17.11,16.69 v17.18,16.76 | C21.2 16.66,15.74 J2.2 | R11.2 13.04,8.47 R7.3 12.11,9.26 v12.31,9.46 | X1.4 11.44,10.88 v11.4,10.84 | v8.96,8.71 8.96,7.57 R7.2 9.01,7.32 v9.01,6.35 | GP25.C 9.13,4.66 v9.11,4.64 | J2.2 v16.61,15.19 v16.62,15.18 | C23.2 19.17,44.79 PICO1.GND@8
  SIG-1 0.305: R14.2 v4.8,41.97 v4.79,41.98 v4.79,41.99 4.64,42.14 C22.2
  SIG-1 0.508: USB1.GND2 7.21,44.3 v7.01,44.1 | USB1.GND 13.66,44.38 v13.76,44.28 | v17.5,43.38 v17.49,43.37 C25.2 16.67,42.07 C24.2 | IC3.2 v14.41,41.12 | C26.2 v12.91,38.15 v12.9,38.14 | ESD1.1 9.73,41.86 v8.82,41.86
  SIG-2 0.15: 11.45,23.31 IC1.PAD
  other vias: 10.49,22.35 9.49,22.35 9.49,23.35 10.49,23.35 11.49,23.35 11.49,22.35 11.49,21.35 10.49,21.35 9.49,21.35 7.57,32.72 6.57,32.72 6.57,33.72 7.57,33.72 8.57,33.72 8.57,32.72 7.57,31.72 6.57,31.72 14.33,4.79 17.8,3.39 18.82,22.93 14.63,26.13 18.74,15.52 3.31,24.89 2.88,22.89 15.38,47.74 17.96,50.6 2.7,37.65 2.47,35.72 2.11,40.82 1.95,28.07 2.18,12.93 2.23,10.32 2.09,2.68 18.44,10.33 18.63,12.82 14.74,11.84 18.59,28.01 18.55,38.22
  pour GND-1 (isolate 0.203, rank 6, no thermals): 0,51 21,51 21,0 0,0
  pour GND-2 (isolate 0.203, rank 6, no thermals): 0,51 21,51 21,0 0,0
  pour SIG-2 (isolate 0.203, rank 6, no thermals): 0,51.02 21,51.02 21,0.02 0,0.02
  pour SIG-1 (isolate 0.203, rank 6, no thermals): 0,51.02 21,51.02 21,0.02 0,0.02
GPIO0
  SIG-1 0.149: IC1.2 6.63,24.55 6.38,24.8 6.38,26.77 4.42,28.73 4.42,38.12 3.4,39.14 3.4,41.22 3,41.62 3,45.31 2.7,45.61 2.7,48.56 PICO1.GP0 PICO1.0
GPIO1
  SIG-1 0.149: IC1.3 6.48,24.15 6.05,24.58 6.05,26.61 4.09,28.57 4.09,37.98 3.06,39.01 3.06,41.09 2.67,41.48 2.67,45.15 1.61,46.21 PICO1.GP1 PICO1.1
GPIO2
  SIG-1 0.149: IC1.4 6.42,23.75 5.73,24.44 5.73,26.46 3.77,28.42 3.77,37.8 2.7,38.87 2.7,40.94 PICO1.GP2 PICO1.2
GPIO3
  SIG-1 0.149: IC1.5 6.36,23.35 5.4,24.31 5.4,26.27 3.44,28.23 3.44,37.66 PICO1.GP3 PICO1.3
GPIO4
  SIG-1 0.149: IC1.6 6.29,22.95 5.07,24.17 5.07,26.13 3.11,28.09 3.11,36.55 2.71,36.95 PICO1.GP4 PICO1.4
GPIO5
  SIG-1 0.149: IC1.7 6.23,22.55 4.75,24.04 4.75,25.93 2.79,27.89 2.79,34.04 2.42,34.41 PICO1.GP5 PICO1.5
GPIO6
  SIG-1 0.149: IC1.8 6.17,22.15 4.42,23.9 4.42,25.78 2.45,27.75 2.45,28.49 PICO1.GP6 PICO1.6
GPIO7
  SIG-1 0.149: IC1.9 6.71,21.75 6.67,21.79 6.07,21.79 4.09,23.77 4.09,25.61 2.92,26.79 PICO1.GP7 PICO1.7
GPIO8
  SIG-1 0.149: IC1.11 6.31,20.95 6.27,20.91 4.87,20.91 3.56,22.22 3.56,23.24 2.55,24.25 PICO1.GP8 PICO1.8
GPIO9
  SIG-1 0.149: IC1.12 4.77,20.55 3.61,21.71 PICO1.GP9 PICO1.9
GPIO10
  SIG-1 0.149: IC1.13 6.56,20.15 3.04,16.63 PICO1.GP10 PICO1.10
GPIO11
  SIG-1 0.149: IC1.14 6.66,19.75 1.61,14.7 PICO1.GP11 PICO1.11
GPIO12
  SIG-1 0.149: IC1.15 7.89,18.51 2.84,13.46 2.84,11.81 2.58,11.55 PICO1.GP12 PICO1.12
GPIO13
  SIG-1 0.149: IC1.16 8.29,18.44 3.17,13.31 3.17,10.57 PICO1.GP13 PICO1.13
GPIO14
  SIG-1 0.149: IC1.17 8.69,18.36 3.49,13.16 3.49,10.43 2.9,9.83 2.9,5.22 PICO1.GP14 PICO1.14
GPIO15
  SIG-1 0.149: IC1.18 9.09,18.27 3.82,12.99 3.82,10.3 3.22,9.7 3.22,5.08 2.71,4.57 2.71,2.49 PICO1.GP15 PICO1.15
GPIO16  (via drill 0.15 pad 0.25)
  SIG-1 0.149: IC1.27 12.73,18.88 12.73,18.45 13.15,18.04 13.15,16.76 v13.34,16.57 | PICO1.GP16 20.99,1.39 PICO1.16
  SIG-2 0.149: v13.34,16.57 13.34,4.35 14.8,2.89 17.89,2.89 PICO1.GP16
GPIO17  (via drill 0.15 pad 0.25)
  SIG-1 0.149: v13.84,16.82 13.47,17.18 13.47,18.17 13.09,18.55 IC1.28 | PICO1.GP17 20.99,3.93 PICO1.17
  SIG-2 0.149: PICO1.GP17 14.43,3.93 13.85,4.51 13.85,16.81 v13.84,16.82
GPIO18
  SIG-1 0.149: IC1.29 15.27,19.75 17.84,17.18 17.84,9.84 18.67,9.01 PICO1.GP18 20.99,9.01 PICO1.18
GPIO19
  SIG-1 0.149: IC1.30 15.33,20.15 18.16,17.32 18.16,12.25 18.86,11.55 PICO1.GP19 20.99,11.55 PICO1.19
GPIO20  (via drill 0.15 pad 0.25)
  SIG-1 0.149: IC1.31 15.39,20.55 17.77,18.17 v17.92,18.17 | PICO1.GP20 20.99,14.09 PICO1.20
  SIG-2 0.149: v17.92,18.17 17.92,15.56 PICO1.GP20
GPIO21
  SIG-1 0.149: IC1.32 14.45,20.95 14.52,20.88 15.53,20.88 17.81,18.6 18.1,18.6 19.39,17.3 PICO1.GP21 20.99,16.63 PICO1.21
GPIO22
  SIG-1 0.149: IC1.34 14.69,21.75 14.72,21.78 19.32,21.78 PICO1.GP22 20.99,21.71 PICO1.22
GPIO24  (via drill 0.15 pad 0.25)
  SIG-1 0.149: R17.1 8.06,42.73 R16.2 8.37,42.74 v8.55,42.57 | IC1.36 16.6,22.55 v16.71,22.66
  SIG-2 0.149: v16.71,22.66 17.63,23.58 17.63,36.5 14.95,39.18 10.44,39.18 9.88,39.74 9.88,41.69 9,42.57 v8.55,42.57
GPIO25  (via drill 0.15 pad 0.25)
  SIG-1 0.15: v15.09,22.98 15.06,22.95 IC1.37
  SIG-1 0.305: R20.1 17,3.95 17.36,4.31 v17.36,4.7
  SIG-2 0.15: v17.36,4.7 14.2,7.86 14.2,15.95 14.65,16.4 14.65,22.54 v15.09,22.98
GPIO26_ADC0
  SIG-1 0.149: IC1.38 14.87,23.35 15.15,23.63 17.14,23.63 19.39,25.88 PICO1.GP26_A0 20.99,26.79 PICO1.26
GPIO27_ADC1
  SIG-1 0.149: IC1.39 14.8,23.75 15.02,23.97 17,23.97 17.99,24.96 17.99,28.27 19.05,29.33 PICO1.GP27_A1 20.99,29.33 PICO1.27
GPIO28_ADC_2
  SIG-1 0.149: IC1.40 14.73,24.15 14.89,24.31 16.88,24.31 17.66,25.09 17.66,30.32 18.01,30.67 18.01,34.03 18.39,34.41 PICO1.GP28_A2 20.99,34.41 PICO1.28
GPIO29_ADC3  (via drill 0.15 pad 0.25)
  SIG-1 0.152: IC1.41 14.62,24.55 14.76,24.69 16.34,24.69 16.41,24.76 16.41,26.78 v16.46,26.83 | v8.91,38.84 7.95,37.88 T1.2
  SIG-2 0.152: v16.46,26.83 15.04,28.25 15.04,29.24 14.93,29.35 14.93,30.15 15.09,30.31 15.83,30.31 15.96,30.44 15.96,32.99 16.53,33.56 16.53,37.14 14.85,38.82 8.93,38.82 v8.91,38.84
N$1
  SIG-1 0.149: USB1.A5 11.69,44.15 R13.1
N$2
  SIG-1 0.254: IC8.3 14.93,12.56 15.58,13.21 15.58,14.46 15.29,14.75 R8.2 J2.1
N$3
  SIG-1 0.149: USB1.B5 8.69,44.27 R12.1
N$4
  SIG-1 0.149: T1.3 7,40.21 7.53,40.73 R19.2 8.07,40.74 R18.1 C27.1
N$5  (via drill 0.15 pad 0.25)
  SIG-1 0.305: GP25.A v12.4,4.66 12.92,4.66 13.63,3.95 R20.2
  SIG-2 0.149: TP5.TP 12.42,4.64 v12.4,4.66
N$6
  SIG-1 0.152: PWR.A R21.2
QSPI_SCLK
  SIG-1 0.149: IC1.52 9.49,28.42 10.33,29.25 10.33,35.84 9.84,36.33 8.51,36.33 8.21,36.02 IC2.6
QSPI_SD0
  SIG-1 0.149: IC2.5 10,35.05 10,29.39 9.09,28.48 IC1.53
QSPI_SD1
  SIG-1 0.149: IC1.55 8.29,28.05 6.93,29.41 IC2.2
QSPI_SD2
  SIG-1 0.149: IC1.54 8.69,28.17 8.21,28.66 IC2.3
QSPI_SD3
  SIG-1 0.149: IC2.7 7.69,36.33 8.05,36.33 8.37,36.65 9.98,36.65 10.65,35.98 10.65,29.12 9.82,28.28 9.82,26.52 9.89,26.45 IC1.51
QSPI_SS
  SIG-1 0.149: IC1.56 7.89,27.95 7.1,28.74 6.2,28.74 5.83,29.11 | IC2.1 5.67,29.27 5.83,29.11 | R5.2 5.83,29.04 5.83,29.11
RESET  (via drill 0.15 pad 0.25)
  SIG-1 0.149: IC1.26 12.29,18.18 12.72,17.75 R1.2 | RESET.1 7.53,6.58 7.53,10.93 7.82,11.23 7.82,11.42 v7.99,11.59 | v13.98,17.74 13.98,18.71 14.06,18.79 | PICO1.RUN 20.99,24.25 PICO1.R
  SIG-1 0.152: v15.09,18.42 14.93,18.58 14.27,18.58 14.06,18.79 13.22,19.63 12.52,19.63 12.29,19.4 IC1.26
  SIG-2 0.149: v13.98,17.74 13.98,17.58 13.4,17 13.16,17 12.3,16.13 12.3,14.73 12,14.42 10.82,14.42 v7.99,11.59
  SIG-2 0.152: PICO1.RUN 19.04,24.25 16.81,22.02 16.81,20.07 15.16,18.42 v15.09,18.42
SWCLK
  SIG-1 0.149: IC1.24 11.49,18.05 11.89,17.65 11.89,15.7 12.8,14.79 12.8,11.28 10.45,8.93 10.45,3.68 8.39,1.62 PICO1.SWCLK PICO1.SWC
SWDIO
  SIG-1 0.149: IC1.25 11.89,18.11 12.21,17.79 12.21,15.84 13.13,14.93 13.13,11.13 10.79,8.8 10.79,3.62 12.79,1.62 PICO1.SWDIO PICO1.SWD
USB_DP_N  (via drill 0.15 pad 0.25)
  SIG-1 0.149: R2.2 12.15,28.81 12.15,36.53 11.1,37.58 11.1,40.31 | USB1.A7 10.19,44.57 10.1,44.48 10.1,44.14 v10.2,44.14 | v11.2,40.21 11.1,40.21 11.1,39.93 | ESD1.3 12.08,40.21 v11.2,40.21 | v11.39,46.32 11.19,46.12 USB1.B7 11.19,44.59 11.1,44.5 11.1,40.5 11.1,40.31 | 11.1,40.31 v11.2,40.21
  SIG-2 0.149: v10.2,44.14 10.1,44.14 10.1,43.56 11.1,42.56 11.1,40.21 v11.2,40.21 | v11.39,46.32 12.15,47.08 TP2.TP
USB_DP_P  (via drill 0.15 pad 0.25)
  SIG-1 0.149: R3.2 11.83,28.81 11.83,36.39 10.78,37.44 10.78,40.31 | USB1.B6 9.69,44.57 9.78,44.48 9.78,44.14 v9.68,44.14 | v10.68,40.21 10.78,40.21 10.78,39.93 | ESD1.2 9.82,40.21 v10.68,40.21 | v10.53,46.31 10.69,46.15 USB1.A6 10.69,44.59 10.78,44.5 10.78,40.54 10.78,40.31 | 10.78,40.31 v10.68,40.21
  SIG-2 0.149: v9.68,44.14 9.78,44.14 9.78,43.42 10.78,42.42 10.78,40.21 v10.68,40.21 | v10.53,46.31 9.69,47.15 TP3.TP
USB_RDP_N
  SIG-1 0.149: IC1.46 11.89,26.42 11.86,26.45 11.86,26.96 12.15,27.25 12.15,27.85 12.34,28.05 R2.1
USB_RDP_P
  SIG-1 0.149: IC1.47 11.49,26.4 11.54,26.45 11.54,27.1 11.82,27.38 11.82,27.88 R3.1
V_SYS  (via drill 0.15 pad 0.25)  (1 unrouted)
  SIG-1 0.149: R15.1 14.33,43.37 | 14.33,43.37 C25.1 | R19.1 8.06,39.58 v8.03,39.55 | v14.37,44.37 14.37,43.41 14.33,43.37 | PICO1.VSYS 20.99,47.11 PICO1.VSY
  SIG-1 0.406: D1.C 17.3,47.11 PICO1.VSYS
  SIG-1 0.508: IC3.1 C25.1 15.37,43.97 16.05,44.65 16.05,45.86 D1.C
  SIG-2 0.149: v8.03,39.55 8.03,42.95 8.63,43.55 8.63,43.95 9.41,44.73 14.01,44.73 v14.37,44.37
VBUS  (via drill 0.2 pad 0.25)  (1 unrouted)
  SIG-1 0.149: R16.1 7.99,43.38 7.99,44.08 | PICO1.VBUS 20.99,49.65 PICO1.VBU
  SIG-1 0.406: PICO1.VBUS 19.24,49.8 16.9,49.8 16.8,49.7 15.89,48.79 13.84,48.79 | 13.84,48.79 13.84,47.95 12.56,46.67 12.56,46.12 12.89,45.79 USB1.VBUS1 | USB1.VBUS2 7.99,45.8 8.28,46.08 8.28,47.72 9.35,48.79 13.84,48.79 | D1.A 16.96,49.86
  SIG-1 0.508: ESD1.4 12.15,42.64 12.85,43.34 12.85,43.73 12.89,43.77 v12.89,44.17 USB1.VBUS1 | USB1.VBUS2 7.99,44.08 v7.88,43.97
VCORE  (via drill 0.15 pad 0.25)
  SIG-1 0.149: IC1.50 10.29,27.14 C12.1 | C11.1 11.09,17.75 IC1.23 11.09,19.57 v11.14,19.62
  SIG-1 0.152: v10.13,24.73 10.29,24.89 IC1.50
  SIG-1 0.254: J3.2 7.8,12.68 v7.91,12.79
  SIG-2 0.149: v11.14,19.62 8.49,19.62 8.36,19.49
  SIG-2 0.406: v7.91,12.79 8.36,13.24 8.36,19.49 8.36,24.3 8.79,24.73 v10.13,24.73
VCORE_EXT  (via drill 0.15 pad 0.25)  (1 unrouted)
  SIG-1 0.152: C31.1 13.72,10.15 13.58,10.29
  SIG-1 0.254: IC8.5 17.18,14.46 17.41,14.69 | 17.41,14.69 C21.1 | 17.41,14.69 17.41,13.67 v17.24,13.5 | R9.1 15.93,10.98 14.27,10.98 13.58,10.29 13.46,10.17 v12.76,10.17 | J3.1 7.12,10.94 v7.08,10.9
  SIG-2 0.254: v7.08,10.9 9.79,10.9 10.52,10.17 v12.76,10.17
VFB
  SIG-1 0.254: R9.2 15.97,11.57 R10.1 IC8.4
VREF
  SIG-1 0.149: 13.52,33.63 13.62,33.63
  SIG-1 0.15: IC5.3 15.87,31.09 15.87,32.75 15.39,33.23 15.35,33.23 14.95,33.63 REF1.1
  SIG-1 0.254: C32.1 13.52,33.63 | REF1.1 13.62,33.63 C17.1 | R6.2 14.84,33.69 REF1.1
VREGO  (via drill 0.15 pad 0.25, 0.2)
  SIG-1 0.15: C9.1 12.61,26.77 v12.33,26.49 12.29,26.45 IC1.45
  SIG-1 0.152: C10.1 v14.99,25.65
  SIG-1 0.305: v9.18,15.58 8.36,15.58 7.12,14.34 J3.3
  SIG-2 0.152: v14.99,25.65 14.72,25.65 14.24,25.17
  SIG-2 0.305: v12.33,26.49 12.29,26.45 12.29,25.45 13.38,25.45 13.46,25.36 14.04,25.36 14.24,25.17 14.24,18.86 11.89,16.52 11.89,16.02 11.45,15.58 v9.18,15.58
XIN
  SIG-1 0.149: IC1.20 9.89,16.46 10.04,16.31 10.04,14.92 C15.1 10.2,14.64 10.2,12.68 9.39,11.87 X1.3
XO_R
  SIG-1 0.149: R4.2 10.71,15.56 C14.1 10.71,14.22 11.36,13.57 X1.1
XOUT
  SIG-1 0.149: IC1.21 10.29,17.73 10.26,17.7 10.26,16.55 R4.1

### Text on the board
tNames: REF | EXT | RP | EXT